# Altium schematic sheet team back ECU.SchDoc
size 184 x 189 mm; Origin: Eagle
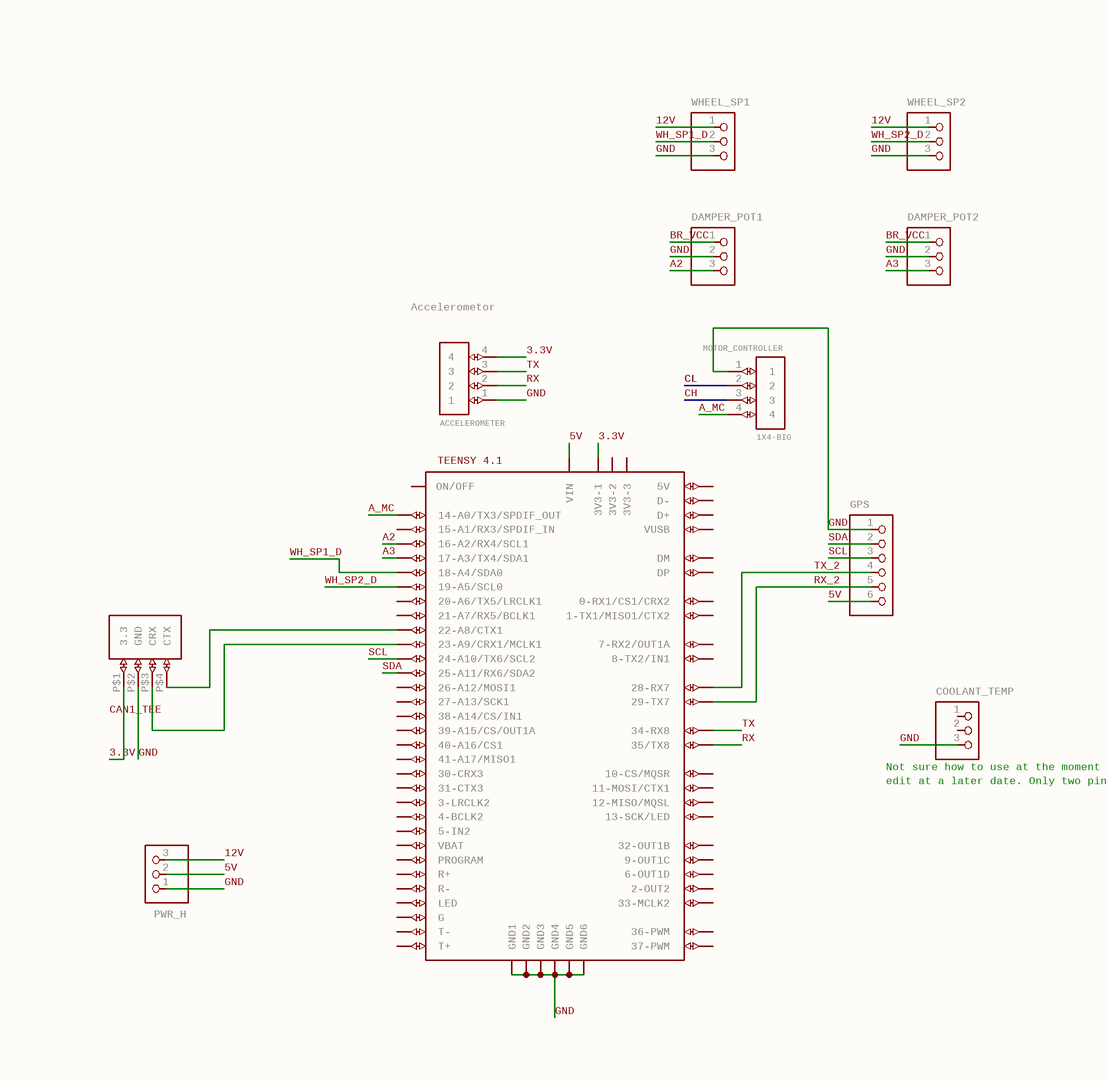
[diagram p0: team back ECU.SchDoc]

## Parts
ACCELEROMETER  AC: Accelerometor  [1X04-3.5MM]
CAN1_TEE  (no value)  [CAN_TEN]
COOLANT_TEMP  (no value)  [1X03]
DAMPER_POT1  (no value)  [1X03-CLEANBIG]
DAMPER_POT2  (no value)  [1X03-CLEANBIG]
GPS  (no value)  [1X06-3.5MM]
MOTOR_CONTROLLER  1X4-BIG  [1X04-BIG]
PWR_H  (no value)  [1X03]
U$1  TEENSY4.1: TEENSY 4.1  [TEENSY41]
WHEEL_SP1  (no value)  [1X03]
WHEEL_SP2  (no value)  [1X03]

## Nets
3.3V: ACCELEROMETER.4 CAN1_TEE.P$1(3.3) U$1.3V3-1
5V: GPS.6 PWR_H.2 U$1.VIN
12V: PWR_H.3 WHEEL_SP1.1 WHEEL_SP2.1
A2: DAMPER_POT1.3 U$1.16-A2/RX4/SCL1
A3: DAMPER_POT2.3 U$1.17-A3/TX4/SDA1
A_MC: MOTOR_CONTROLLER.4 U$1.14-A0/TX3/SPDIF_OUT
BR_VCC: DAMPER_POT1.1 DAMPER_POT2.1
GND: ACCELEROMETER.1 CAN1_TEE.P$2(GND) COOLANT_TEMP.3 DAMPER_POT1.2 DAMPER_POT2.2 GPS.1 MOTOR_CONTROLLER.1 PWR_H.1 U$1.GND1 U$1.GND2 U$1.GND3 U$1.GND4 U$1.GND5 U$1.GND6 WHEEL_SP1.3 WHEEL_SP2.3
RX: ACCELEROMETER.2 U$1.35-TX8(35/TX8)
RX_2: GPS.5 U$1.29-TX7
SCL: GPS.3 U$1.24-A10/TX6/SCL2
SDA: GPS.2 U$1.25-A11/RX6/SDA2
TX: ACCELEROMETER.3 U$1.34-RX8
TX_2: GPS.4 U$1.28-RX7
WH_SP1_D: U$1.18-A4/SDA0 WHEEL_SP1.2
WH_SP2_D: U$1.19-A5/SCL0 WHEEL_SP2.2
NetCAN1_TEE_P$3: CAN1_TEE.P$3(CRX) U$1.23-A9/CRX1/MCLK1
NetCAN1_TEE_P$4: CAN1_TEE.P$4(CTX) U$1.22-A8/CTX1

Not connected (* = marked no-connect by the designer): COOLANT_TEMP 1 2; MOTOR_CONTROLLER 2 3; U$1 0-RX1/CS1/CRX2 1-TX1/MISO1/CTX2 2-OUT2 3-LRCLK2 3V3-2 3V3-3 4-BCLK2 5-IN2 6-OUT1D 7-RX2/OUT1A 8-TX2/IN2(8-TX2/IN1) 9-OUT1C 10-CS\MQSR(10-CS/MQSR) 11-MOSI/CTX1 12-MISO/MQSL 13-SCK/LED 15-A1/RX3/SPDIF_IN 20-A6/TX5/LRCLK1 21-A7/RX5/BCLK1 26-A12/MOSI1 27-A13/SCK1 30-CRX3 31-CTX3 32-OUT1B 33-MCLK2 36-PWM 37-PWM 38-A14/CS/IN1 39-A15/CS/OUT1A 40-A16/CS1 41-A17/MISO1 +5V(5V) D+ D- DM DP G LED ON/OFF PROGRAM R+ R- T+ T- VBAT VUSB

## Buses and harness runs
bus CH
bus CL

## Notes on the sheet
- (near COOLANT_TEMP) Not sure how to use at the moment
- (near COOLANT_TEMP) edit at a later date. Only two pins

## Library data of the parts
ACCELEROMETER = 1X4-3.5MM: 4-pin connector; GateName_1: G$1; SymbolName_1: 1X4; DeviceName: -3.5MM; LibraryName: adafruit; DeviceSetName: 1X4
CAN1_TEE = CAN_TEE: GateName_1: G$1; SymbolName_1: CAN_TEN; LibraryName: F-E library custom components; DeviceSetName: CAN_TEE
COOLANT_TEMP PWR_H WHEEL_SP1 WHEEL_SP2 = PINHD-1X3: PIN HEADER; GateName_1: A; SymbolName_1: PINHD3; LibraryName: adafruit; DeviceSetName: PINHD-1X3
DAMPER_POT1 DAMPER_POT2 = PINHD-1X3CB: PIN HEADER; GateName_1: A; SymbolName_1: PINHD3; DeviceName: CB; LibraryName: adafruit; DeviceSetName: PINHD-1X3
GPS = PINHD-1X6-3.5MM: PIN HEADER; GateName_1: A; SymbolName_1: PINHD6; DeviceName: -3.5MM; LibraryName: adafruit; DeviceSetName: PINHD-1X6
MOTOR_CONTROLLER = 1X4-BIG: 4-pin connector; GateName_1: G$1; SymbolName_1: 1X4; DeviceName: -BIG; LibraryName: adafruit; DeviceSetName: 1X4
U$1 = TEENSY41: GateName_1: G$1; SymbolName_1: TEENSY41; LibraryName: teensy; DeviceSetName: TEENSY41